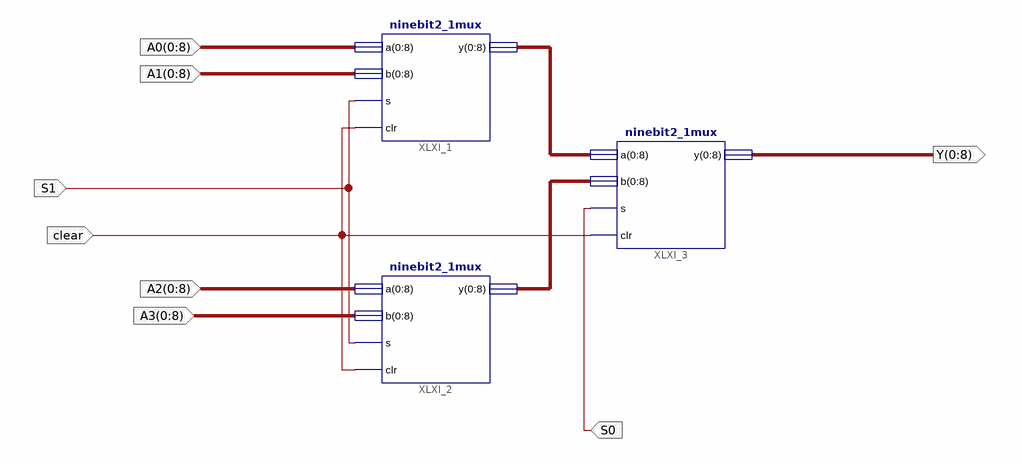
[diagram p0: schematic sheet 1]
// Xilinx ISE schematic mux4to1_9bit.sch (artix7) as structural Verilog: 3 symbols, 8 ports
module mux4to1_9bit (
  input  [0:8] A0,
  input  [0:8] A1,
  input  [0:8] A2,
  input  [0:8] A3,
  input  S0,
  input  clear,
  input  S1,
  output [0:8] Y
);

  wire [8:0] XLXN_11, XLXN_12;

  ninebit2_1mux XLXI_1 (
    .a(A0), .b(A1), .s(S1), .clr(clear),
    .y({XLXN_11[0], XLXN_11[1], XLXN_11[2], XLXN_11[3], XLXN_11[4], XLXN_11[5], XLXN_11[6], XLXN_11[7], XLXN_11[8]}));
  ninebit2_1mux XLXI_2 (
    .a(A2), .b(A3), .s(S1), .clr(clear),
    .y({XLXN_12[0], XLXN_12[1], XLXN_12[2], XLXN_12[3], XLXN_12[4], XLXN_12[5], XLXN_12[6], XLXN_12[7], XLXN_12[8]}));
  ninebit2_1mux XLXI_3 (
    .a({XLXN_11[0], XLXN_11[1], XLXN_11[2], XLXN_11[3], XLXN_11[4], XLXN_11[5], XLXN_11[6], XLXN_11[7], XLXN_11[8]}),
    .b({XLXN_12[0], XLXN_12[1], XLXN_12[2], XLXN_12[3], XLXN_12[4], XLXN_12[5], XLXN_12[6], XLXN_12[7], XLXN_12[8]}),
    .s(S0), .clr(clear), .y(Y));
endmodule
